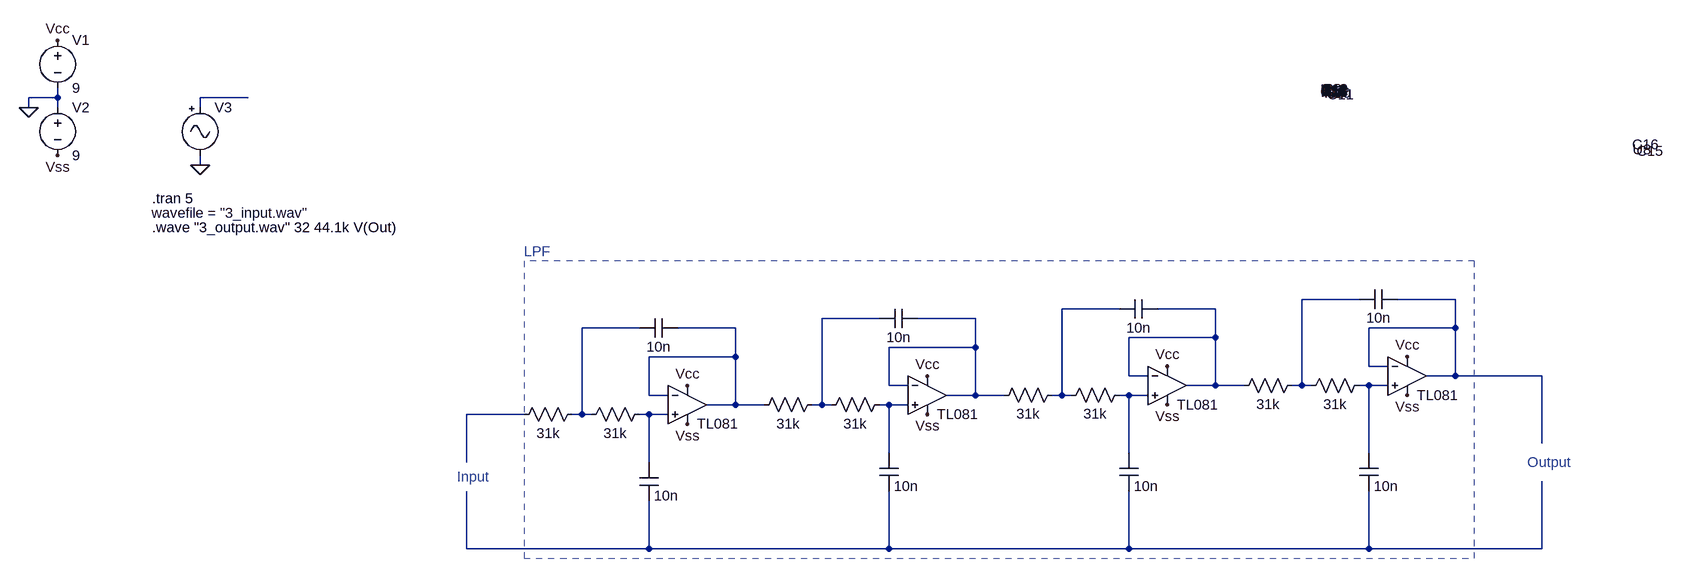
[diagram p0: schematic 3_LPF.asc]
3_LPF.asc, the LTspice schematic file:
Version 4
SHEET 1 3116 980
WIRE -928 208 -928 192
WIRE -928 208 -976 208
WIRE -512 208 -592 208
WIRE -976 224 -976 208
WIRE -928 224 -928 208
WIRE -592 224 -592 208
WIRE -592 320 -592 304
WIRE 1552 544 1456 544
WIRE 1712 544 1616 544
WIRE 1152 560 1056 560
WIRE 1312 560 1216 560
WIRE 752 576 656 576
WIRE 912 576 816 576
WIRE 352 592 256 592
WIRE 512 592 416 592
WIRE 1712 592 1712 544
WIRE 1712 592 1568 592
WIRE 1312 608 1312 560
WIRE 1312 608 1168 608
WIRE 912 624 912 576
WIRE 912 624 768 624
WIRE 512 640 512 592
WIRE 512 640 368 640
WIRE 1568 656 1568 592
WIRE 1600 656 1568 656
WIRE 1168 672 1168 608
WIRE 1200 672 1168 672
WIRE 1712 672 1712 592
WIRE 1712 672 1664 672
WIRE 1856 672 1712 672
WIRE 768 688 768 624
WIRE 800 688 768 688
WIRE 1312 688 1312 608
WIRE 1312 688 1264 688
WIRE 1360 688 1312 688
WIRE 1456 688 1456 544
WIRE 1456 688 1440 688
WIRE 1472 688 1456 688
WIRE 1568 688 1552 688
WIRE 1600 688 1568 688
WIRE 368 704 368 640
WIRE 400 704 368 704
WIRE 912 704 912 624
WIRE 912 704 864 704
WIRE 960 704 912 704
WIRE 1056 704 1056 560
WIRE 1056 704 1040 704
WIRE 1072 704 1056 704
WIRE 1168 704 1152 704
WIRE 1200 704 1168 704
WIRE 512 720 512 640
WIRE 512 720 464 720
WIRE 560 720 512 720
WIRE 656 720 656 576
WIRE 656 720 640 720
WIRE 672 720 656 720
WIRE 768 720 752 720
WIRE 800 720 768 720
WIRE 160 736 64 736
WIRE 256 736 256 592
WIRE 256 736 240 736
WIRE 272 736 256 736
WIRE 368 736 352 736
WIRE 400 736 368 736
WIRE 1856 784 1856 672
WIRE 768 800 768 720
WIRE 1168 800 1168 704
WIRE 1568 800 1568 688
WIRE 64 816 64 736
WIRE 368 816 368 736
WIRE 64 960 64 864
WIRE 368 960 368 880
WIRE 368 960 64 960
WIRE 768 960 768 864
WIRE 768 960 368 960
WIRE 1168 960 1168 864
WIRE 1168 960 768 960
WIRE 1568 960 1568 864
WIRE 1568 960 1168 960
WIRE 1856 960 1856 848
WIRE 1856 960 1568 960
FLAG -976 224 0
FLAG -928 112 Vcc
FLAG -928 304 Vss
FLAG -592 320 0
FLAG 432 688 Vcc
FLAG 432 752 Vss
FLAG 832 672 Vcc
FLAG 832 736 Vss
FLAG 1232 656 Vcc
FLAG 1232 720 Vss
FLAG 1632 640 Vcc
FLAG 1632 704 Vss
SYMBOL voltage -928 96 R0
WINDOW 123 0 0 Left 0
WINDOW 39 0 0 Left 0
SYMATTR InstName V1
SYMATTR Value 9
SYMBOL voltage -928 208 R0
WINDOW 123 0 0 Left 0
WINDOW 39 0 0 Left 0
SYMATTR InstName V2
SYMATTR Value 9
SYMBOL Misc\\signal -592 208 R0
WINDOW 3 -81 192 Left 2
SYMATTR Value wavefile = "3_input.wav"
SYMATTR InstName V3
SYMBOL res 368 720 R90
WINDOW 0 -511 -1140 VBottom 2
WINDOW 3 32 56 VTop 2
SYMATTR InstName R9
SYMATTR Value 31k
SYMBOL res 256 720 R90
WINDOW 0 -504 -1260 VBottom 2
WINDOW 3 32 56 VTop 2
SYMATTR InstName R10
SYMATTR Value 31k
SYMBOL cap 352 816 R0
WINDOW 0 1146 -616 Left 2
SYMATTR InstName C9
SYMATTR Value 10n
SYMBOL cap 416 576 R90
WINDOW 0 -365 -1096 VBottom 2
WINDOW 3 32 32 VTop 2
SYMATTR InstName C10
SYMATTR Value 10n
SYMBOL AutoGenerated\\TL081 432 656 R0
WINDOW 0 1063 -459 Left 2
SYMATTR InstName U5
SYMBOL res 768 704 R90
WINDOW 0 -493 -744 VBottom 2
WINDOW 3 32 56 VTop 2
SYMATTR InstName R11
SYMATTR Value 31k
SYMBOL res 656 704 R90
WINDOW 0 -491 -854 VBottom 2
WINDOW 3 32 56 VTop 2
SYMATTR InstName R12
SYMATTR Value 31k
SYMBOL cap 752 800 R0
WINDOW 0 747 -597 Left 2
SYMATTR InstName C11
SYMATTR Value 10n
SYMBOL cap 816 560 R90
WINDOW 0 -351 -695 VBottom 2
WINDOW 3 32 32 VTop 2
SYMATTR InstName C12
SYMATTR Value 10n
SYMBOL AutoGenerated\\TL081 832 640 R0
WINDOW 0 665 -440 Left 2
SYMATTR InstName U6
SYMBOL res 1168 688 R90
WINDOW 0 -478 -341 VBottom 2
WINDOW 3 32 56 VTop 2
SYMATTR InstName R13
SYMATTR Value 31k
SYMBOL res 1056 688 R90
WINDOW 0 -475 -454 VBottom 2
WINDOW 3 32 56 VTop 2
SYMATTR InstName R14
SYMATTR Value 31k
SYMBOL cap 1152 800 R0
WINDOW 0 335 -602 Left 2
SYMATTR InstName C13
SYMATTR Value 10n
SYMBOL cap 1216 544 R90
WINDOW 0 -332 -294 VBottom 2
WINDOW 3 32 32 VTop 2
SYMATTR InstName C14
SYMATTR Value 10n
SYMBOL AutoGenerated\\TL081 1232 624 R0
WINDOW 0 262 -426 Left 2
SYMATTR InstName U7
SYMBOL res 1568 672 R90
WINDOW 0 -458 58 VBottom 2
WINDOW 3 32 56 VTop 2
SYMATTR InstName R15
SYMATTR Value 31k
SYMBOL res 1456 672 R90
WINDOW 0 -458 -55 VBottom 2
WINDOW 3 32 56 VTop 2
SYMATTR InstName R16
SYMATTR Value 31k
SYMBOL cap 1552 800 R0
WINDOW 0 1516 -503 Left 2
SYMATTR InstName C15
SYMATTR Value 10n
SYMBOL cap 1616 528 R90
WINDOW 0 -226 -1467 VBottom 2
WINDOW 3 32 32 VTop 2
SYMATTR InstName C16
SYMATTR Value 10n
SYMBOL AutoGenerated\\TL081 1632 608 R0
WINDOW 0 1429 -314 Left 2
SYMATTR InstName U8
TEXT -672 376 Left 2 !.tran 5
TEXT -672 424 Left 2 !.wave "3_output.wav" 32 44.1k V(Out)
TEXT 160 464 Left 2 ;LPF
TEXT 48 840 Left 2 ;Input
TEXT 1832 816 Left 2 ;Output
RECTANGLE Normal 160 976 1744 480 2

The netlist it stands for:
* 3_LPF.asc
V1 Vcc 0 9
V2 0 Vss 9
V3 N001 0 wavefile = "3_input.wav"
R9 N014 N008 31k
R10 N008 N013 31k
C9 N014 N015 10n
C10 N009 N008 10n
* U5: TL081 (symbol AutoGenerated\TL081 not available, pins judged from their places): In+=N014 In-=N009 V+=Vcc V-=Vss OUT=N009
R11 N012 N006 31k
R12 N006 N009 31k
C11 N012 N015 10n
C12 N007 N006 10n
* U6: TL081 (symbol AutoGenerated\TL081 not available, pins judged from their places): In+=N012 In-=N007 V+=Vcc V-=Vss OUT=N007
R13 N011 N004 31k
R14 N004 N007 31k
C13 N011 N015 10n
C14 N005 N004 10n
* U7: TL081 (symbol AutoGenerated\TL081 not available, pins judged from their places): In+=N011 In-=N005 V+=Vcc V-=Vss OUT=N005
R15 N010 N002 31k
R16 N002 N005 31k
C15 N010 N015 10n
C16 N003 N002 10n
* U8: TL081 (symbol AutoGenerated\TL081 not available, pins judged from their places): In+=N010 In-=N003 V+=Vcc V-=Vss OUT=N003
.tran 5
.wave "3_output.wav" 32 44.1k V(Out)
* LPF
* Input
* Output
.backanno
.end